# Altium schematic sheet dwm1000_optional.SchDoc
size A4
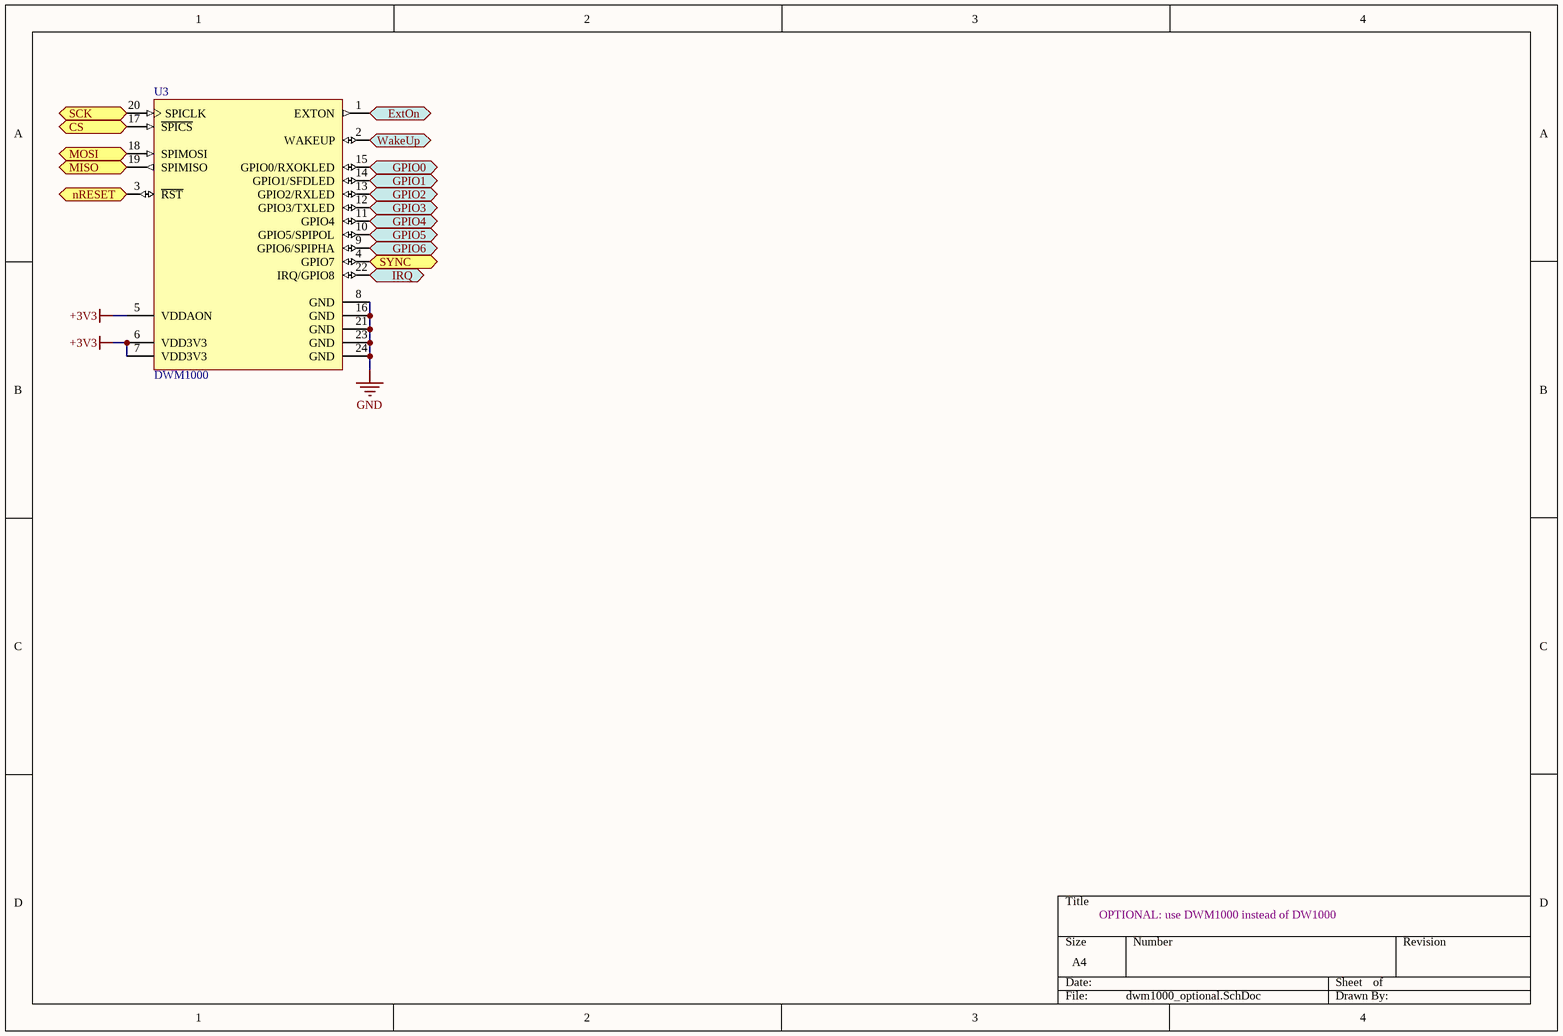
[diagram p0: dwm1000_optional.SchDoc]

## Parts
U3  DWM1000  [DECW-DWM1000-24_V]

## Ports
CS (in), ExtOn (out), GPIO0 (bidir), GPIO1 (bidir), GPIO2 (bidir), GPIO3 (bidir), GPIO4 (bidir), GPIO5 (bidir), GPIO6 (bidir), IRQ (bidir), MISO (out), MOSI (in), nRESET (bidir), SCK (in), SYNC (bidir), WakeUp (bidir)

## Nets
+3V3: U3.5(VDDAON) U3.6(VDD3V3) U3.7(VDD3V3)
GND: U3.8(GND) U3.16(GND) U3.21(GND) U3.23(GND) U3.24(GND)
CS: U3.17(~{SPICS}) ; port CS
ExtOn: U3.1(EXTON) ; port ExtOn
GPIO0: U3.15(GPIO0/RXOKLED) ; port GPIO0
GPIO1: U3.14(GPIO1/SFDLED) ; port GPIO1
GPIO2: U3.13(GPIO2/RXLED) ; port GPIO2
GPIO3: U3.12(GPIO3/TXLED) ; port GPIO3
GPIO4: U3.11(GPIO4) ; port GPIO4
GPIO5: U3.10(GPIO5/SPIPOL) ; port GPIO5
GPIO6: U3.9(GPIO6/SPIPHA) ; port GPIO6
IRQ: U3.22(IRQ/GPIO8) ; port IRQ
MISO: U3.19(SPIMISO) ; port MISO
MOSI: U3.18(SPIMOSI) ; port MOSI
nRESET: U3.3(~{RST}) ; port nRESET
SCK: U3.20(SPICLK) ; port SCK
SYNC: U3.4(GPIO7) ; port SYNC
WakeUp: U3.2(WAKEUP) ; port WakeUp

## Notes on the sheet
- OPTIONAL: use DWM1000 instead of DW1000

## Library data of the parts
U3 = CMP-2000-05094-1: DW M1000 IEEE 802.15.4 -2011 UWB Transceiver Module; Manufacturer: Decawave; Voltage - Supply: 2.8V~3.6V; Protocol: IR-UWB; Featured Product: ScenSorDWM1000Module; Design Resources: DevelopmentToolSelector; Frequency: 3.5GHz~6.5GHz; Antenna Type: Integrated,Chip; Other Names: 1479-1002-2RUPF-G001A; Current - Receiving: 64mA; Data Rate: 6.8Mbps; Serial Interfaces: SPI; Current - Transmitting: 31mA; Modulation: BPM,BPSK; Standard Package: 500; Series: -; RF Family/Standard: 802.15.4; Operating Temperature: -40degC~85degC; Sensitivity: -; Packaging: Tape&Reel(TR); Datasheet Version: Rev. V1.0, 12/2015; Power - Output: -; Family: RFTransceiverModules; Memory Size: -; Package / Case: Module; Mounting Type: SurfaceMount; Datasheet URL: http://www.decawave.com/sites/default/files/resources/dwm1000-datasheet-v1.3.pdf; Online Catalog: ScenSorDWM1000Module; Category: RF/IFandRFID; Manufacturer URL: http://www.decawave.com/